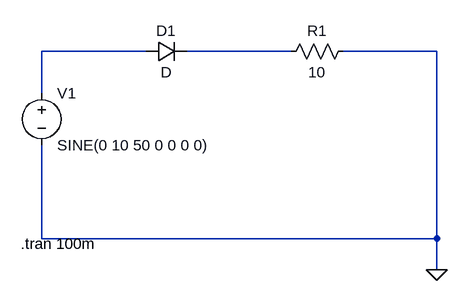
[diagram p0: schematic rectification-v1.asc]
rectification-v1.asc, the LTspice schematic file:
Version 4.1
SHEET 1 880 680
WIRE 176 96 16 96
WIRE 400 96 240 96
WIRE 624 96 480 96
WIRE 16 160 16 96
WIRE 16 384 16 240
WIRE 624 384 624 96
WIRE 624 384 16 384
WIRE 624 432 624 384
FLAG 624 432 0
SYMBOL voltage 16 144 R0
WINDOW 123 0 0 Left 0
WINDOW 39 0 0 Left 0
SYMATTR InstName V1
SYMATTR Value SINE(0 10 50 0 0 0 0)
SYMBOL diode 176 112 R270
WINDOW 0 32 32 VTop 2
WINDOW 3 0 32 VBottom 2
SYMATTR InstName D1
SYMBOL res 496 80 R90
WINDOW 0 0 56 VBottom 2
WINDOW 3 32 56 VTop 2
SYMATTR InstName R1
SYMATTR Value 10
TEXT -16 392 Left 2 !.tran 100m

The netlist it stands for:
* rectification-v1.asc
V1 N001 0 SINE(0 10 50 0 0 0 0)
D1 N001 N002 D
R1 0 N002 10
.model D D
.lib standard.dio
.tran 100m
.backanno
.end